# EAGLE design controlStepperMotor (EAGLE 9.6.2)
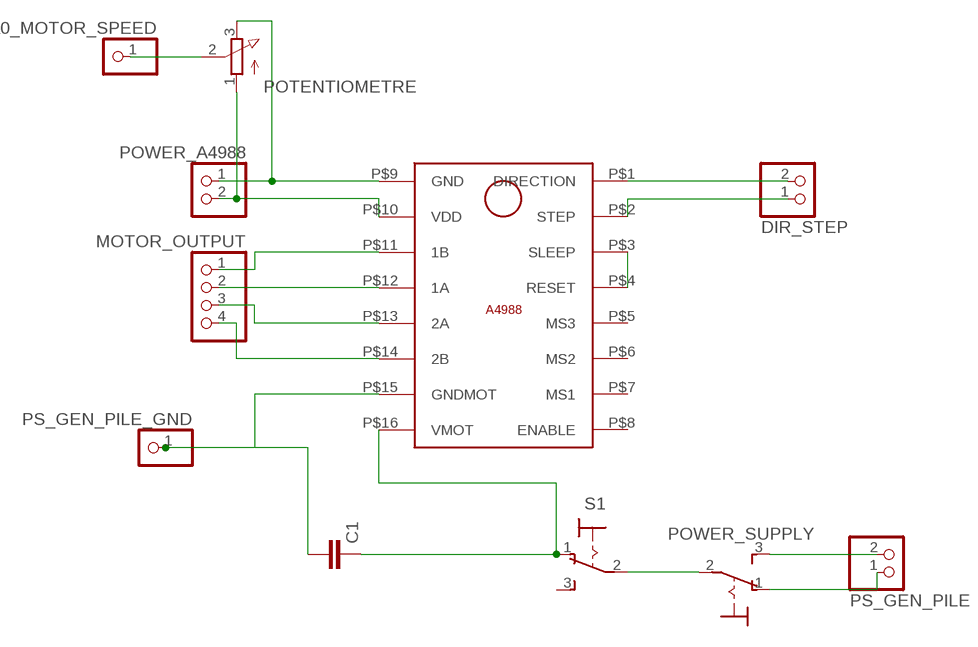
[diagram p0: schematic, sheet 1]

## Parts
A0_MOTOR_SPEED  PINHD-1X1  [1X01]
C1  C2,5-3  [C2.5-3]
DIR_STEP  PINHD-1X2  [1X02]
MOTOR_OUTPUT  PINHD-1X4  [1X04]
POTENTIOMETRE  3RP/1610N  [3RP/1610N]
POWER_A4988  PINHD-1X2  [1X02]
POWER_SUPPLY  320-916  [320-916]
PS_GEN_PILE  PINHD-1X2  [1X02]
PS_GEN_PILE_GND  PINHD-1X1  [1X01]
S1  M9040P  [M9040P]
U$1  A4988-DRIVER-MOTOR  [A4988-DRIVER-MOTOR]

## Nets
N$2: DIR_STEP.2 U$1.P$1(DIRECTION)
N$3: DIR_STEP.1 U$1.P$2(STEP)
N$4: POTENTIOMETRE.3(E) POWER_A4988.1 U$1.P$9(GND)
N$5: POTENTIOMETRE.1(A) POWER_A4988.2 U$1.P$10(VDD)
N$6: MOTOR_OUTPUT.1 U$1.P$11(1B)
N$7: MOTOR_OUTPUT.2 U$1.P$12(1A)
N$8: MOTOR_OUTPUT.3 U$1.P$13(2A)
N$9: MOTOR_OUTPUT.4 U$1.P$14(2B)
N$10: POWER_SUPPLY.2(P) S1.2(P)
N$11: C1.1 S1.1(O) U$1.P$16(VMOT)
N$12: C1.2 PS_GEN_PILE_GND.1 U$1.P$15(GNDMOT)
N$13: POWER_SUPPLY.3(S) PS_GEN_PILE.2
N$14: POWER_SUPPLY.1(O) PS_GEN_PILE.1
N$15: A0_MOTOR_SPEED.1 POTENTIOMETRE.2(S)
N$16: U$1.P$4(RESET)
Unconnected: S1.3(S) U$1.P$3(SLEEP) U$1.P$5(MS3) U$1.P$6(MS2) U$1.P$7(MS1) U$1.P$8(ENABLE)

## Library data of the parts
A0_MOTOR_SPEED PS_GEN_PILE_GND = pinhead:PINHD-1X1: PIN HEADER
C1 = capacitor-wima:C: CAPACITOR naming: grid - package width
DIR_STEP POWER_A4988 PS_GEN_PILE = pinhead:PINHD-1X2: PIN HEADER
MOTOR_OUTPUT = pinhead:PINHD-1X4: PIN HEADER
POTENTIOMETRE = pot:3RP/1610N: 16mm Potentiometer one level Source: http://www.alphapotentiometers.net/html/16mm_pot_2.html
POWER_SUPPLY = switch:320-916: TOGGLE SWITCH distributor RS Components
S1 = switch:M9040P: TOGGLE SWITCH Marquardt
U$1 = A4988:A4988-DRIVER-MOTOR

## Board
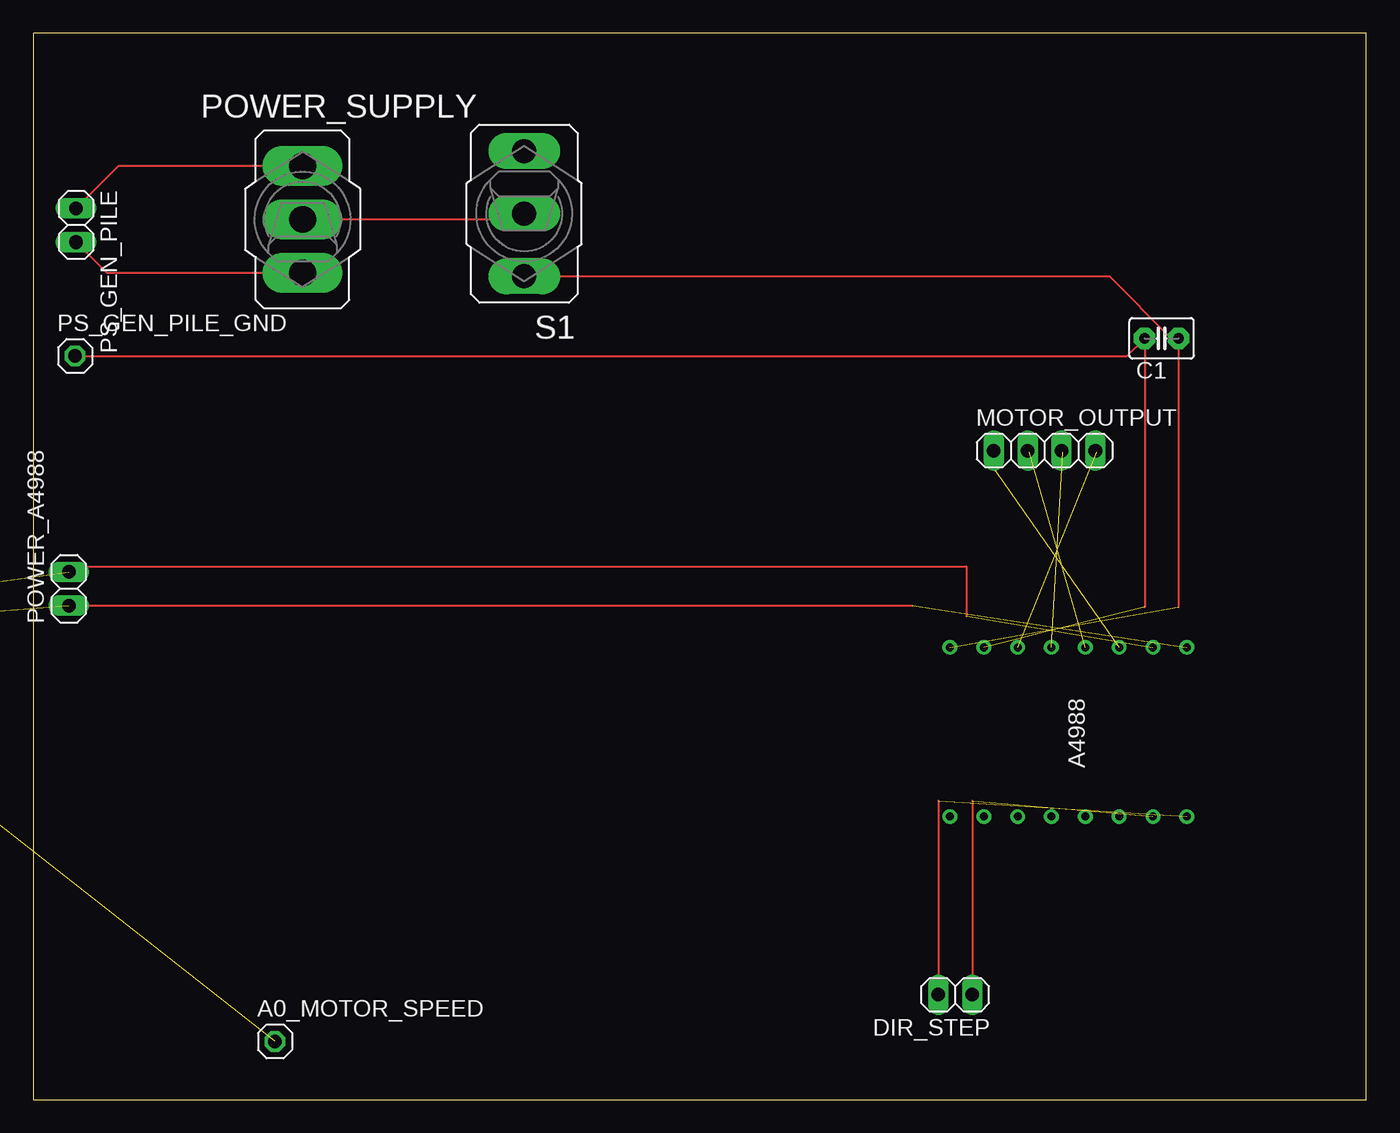
[diagram p1: board, top side]
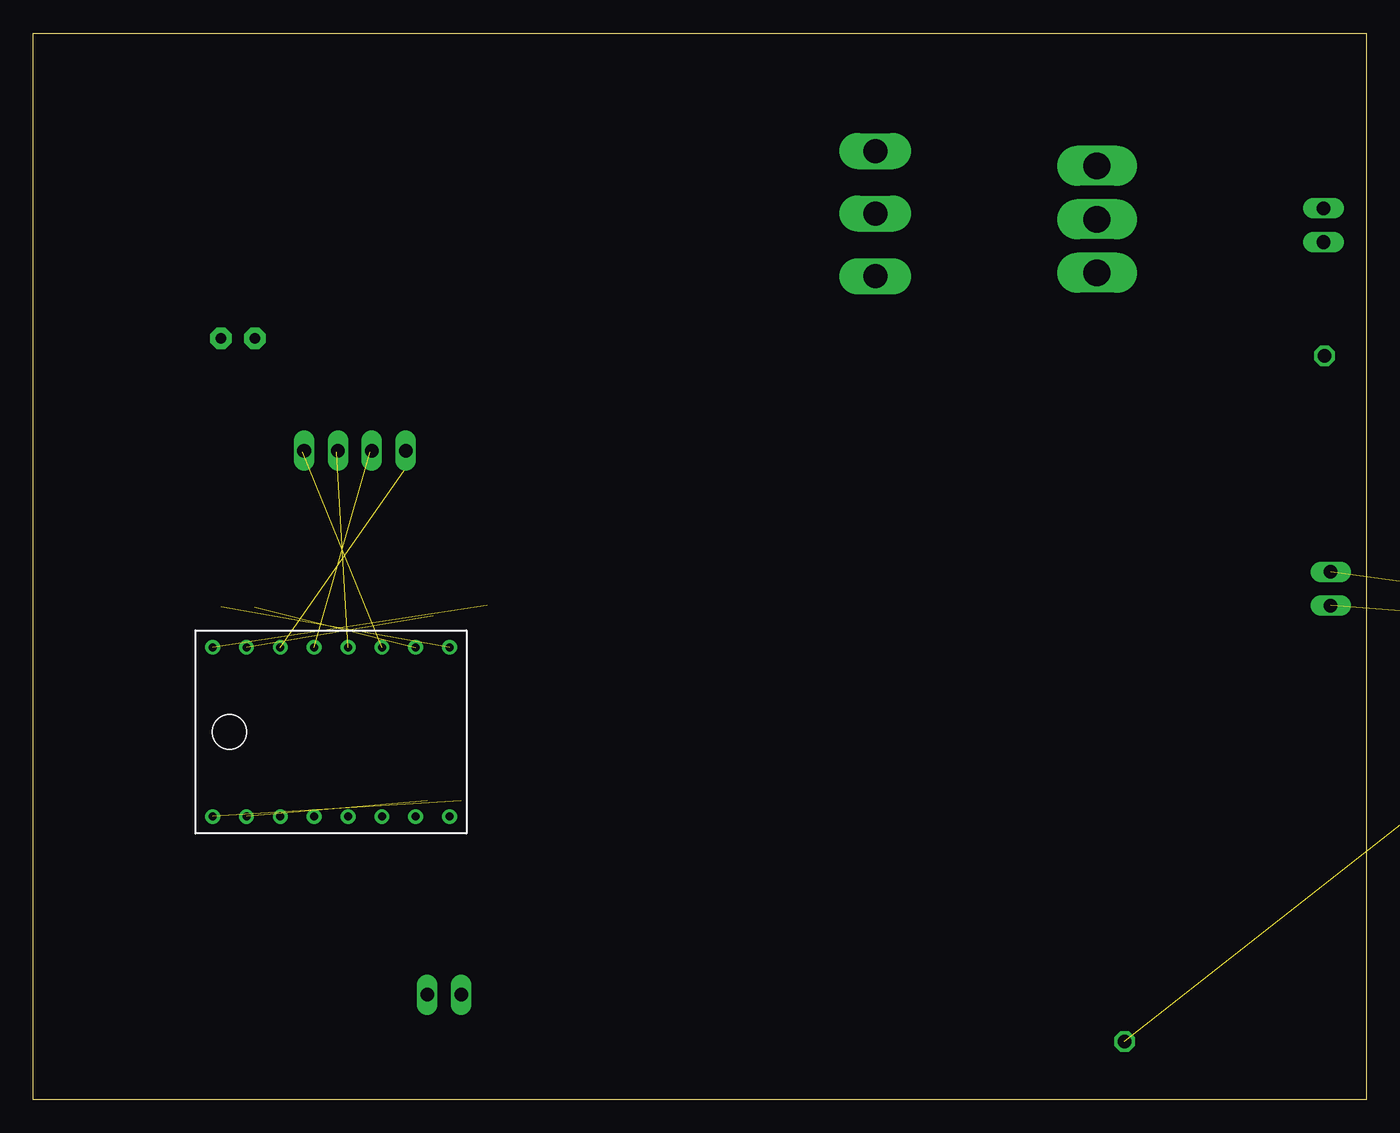
[diagram p2: board, bottom side, seen from below]

Size 100 x 80 mm. Coordinates in mm from the lower left corner, seen from the top.
Outline: 0,0 100,0 100,80 0,80 0,0
Copper layers (1*16): Top 0.035mm / dielectric 1.5mm / Bottom 0.035mm
Design rules "default": minimum track width 6mil, minimum drill 0.35mm, track to track 6mil, track to pad 6mil, pad to pad 6mil, via to via 6mil, smd to smd 6mil, copper to edge 40mil, drill to drill 6mil, minimum pad ring 10mil, minimum via ring 8mil, stop-mask expansion 4mil, vias tented up to drill 0mil, thermal gap 10mil

### Footprints (pad centres in the part's own frame; a part is rotated, then mirrored left to right if it is on the bottom)
1X01 = drill 1.016 octagon: 1 0,0
C2.5-3 = drill 0.813 pad 1.6 octagon: 1 -1.27,0; 2 1.27,0
1X02 = drill 1.016 long: 1 -1.27,0; 2 1.27,0
1X04 = drill 1.016 long: 1 -3.81,0; 2 -1.27,0; 3 1.27,0; 4 3.81,0
3RP/1610N = drill 1.2 pad 2.184: 1 -5,0; 2 0,0; 3 5,0
320-916 = drill 2.007 long: 1 0,4.013; 2 0,0; 3 0,-4.013
M9040P = drill 1.803 long: 1 0,4.699; 2 0,0; 3 0,-4.699
A4988-DRIVER-MOTOR = drill 0.6: P$1 1.27,19.05; P$2 1.27,16.51; P$3 1.27,13.97; P$4 1.27,11.43; P$5 1.27,8.89; P$6 1.27,6.35; P$7 1.27,3.81; P$8 1.27,1.27; P$9 -11.43,19.05; P$10 -11.43,16.51; P$11 -11.43,13.97; P$12 -11.43,11.43; P$13 -11.43,8.89; P$14 -11.43,6.35; P$15 -11.43,3.81; P$16 -11.43,1.27

### Placement (x,y rotation side)
A0_MOTOR_SPEED  18.13,4.36 0 top
C1  84.65,57.11 180 top
DIR_STEP  69.17,7.86 180 top
MOTOR_OUTPUT  75.87,48.69 0 top
POTENTIOMETRE  -21.59,35.56 0 top  (outside the outline)
POWER_A4988  2.66,38.33 90 top
POWER_SUPPLY  20.2,66.04 0 top
PS_GEN_PILE  3.21,65.6 270 top
PS_GEN_PILE_GND  3.13,55.79 0 top
S1  36.83,66.47 180 top
U$1  67.5,22.5 270 top

### Tracks (layer width: path | path; a pad name or v marks a point on that pad's centre or on a via)
N$2  (1 unrouted)
  Top 0.152: 67.9,22.41 DIR_STEP.2
N$3  (1 unrouted)
  Top 0.152: 70.44,22.41 DIR_STEP.1
N$4  (2 unrouted)
  Top 0.152: POWER_A4988.1 65.95,37.06
N$5  (2 unrouted)
  Top 0.152: POWER_A4988.2 3.06,40 70,40 70,36.27
N$6  (1 unrouted)
  Top 0.152: 72.18,47.18 72.5,47.5 72.5,48.25 MOTOR_OUTPUT.1
N$7  (1 unrouted)
  Top 0.152: MOTOR_OUTPUT.2 74.72,48.57
N$8  (1 unrouted)
  Top 0.152: MOTOR_OUTPUT.3 77.26,48.57
N$9  (1 unrouted)
  Top 0.152: MOTOR_OUTPUT.4 79.8,48.57
N$10
  Top 0.152: POWER_SUPPLY.2 36.4,66.04 S1.2
N$11  (1 unrouted)
  Top 0.152: S1.1 80.73,61.77 85.39,57.11 C1.1 85.92,36.95
N$12  (1 unrouted)
  Top 0.152: 3.38,56.04 PS_GEN_PILE_GND.1 82.06,55.79 C1.2 83.38,36.95
N$13
  Top 0.152: PS_GEN_PILE.2 5.51,62.03 POWER_SUPPLY.3
N$14
  Top 0.152: PS_GEN_PILE.1 6.39,70.05 POWER_SUPPLY.1
N$15  (1 unrouted)